# Altium project ECE453-S22.PrjPcb
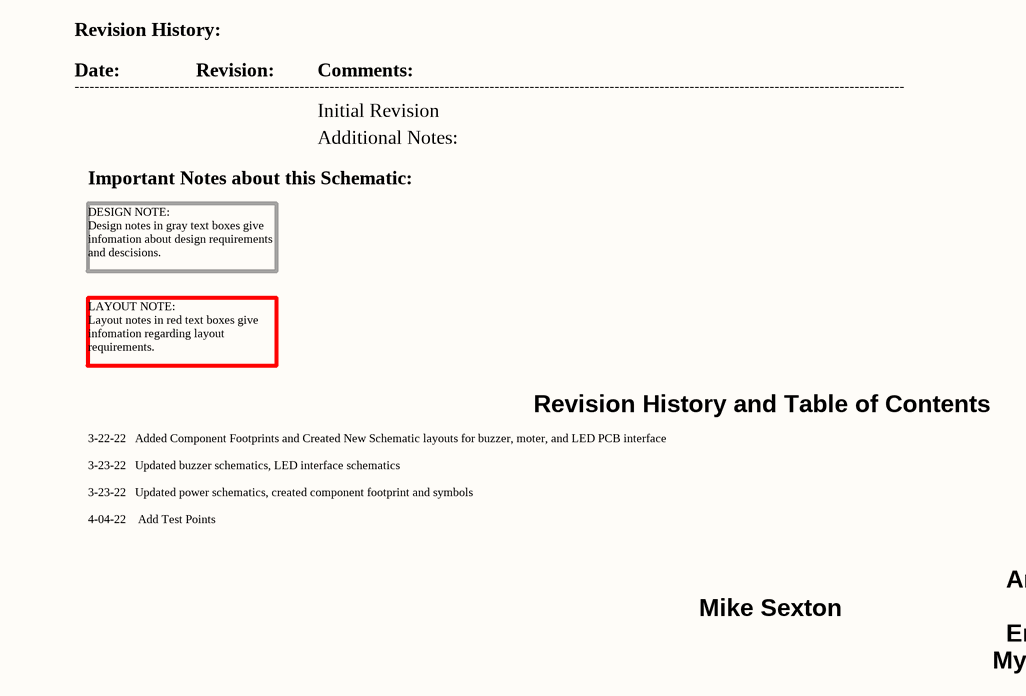
[diagram p0: 01-Revision_History_and_Contents.SchDoc]
6 sheets, 33 parts. Net scope: global (net labels, ports and power ports of the same name join across sheets).
Board file: ECE453_Interface.PcbDoc
Sheets:
  01-Revision_History_and_Contents.SchDoc
  02-Power.SchDoc
  03_MCU.SchDoc
  04_Motor.SchDoc
  05_Buzzer.SchDoc
  06_LEDs.SchDoc

## Sheet 01-Revision_History_and_Contents.SchDoc: Revision History and Contents
size A; Date: 4/25/2017; ApprovedBy: JSK; CheckedBy: JSK; Author: JSK; CompanyName: University of Wisconsin; DrawnBy: JSK; Engineer: JSK; Organization: ECE 315; Address1: College of Engineering; Address2: 1415 Engineering Drive; Address3: Madison, WI 53706; Address4: ECE 453 Spring 2017; Revision: A; SheetNumber: 1; SheetTotal: 2

### Notes on the sheet
- Revision History:
- Date:
- ----------------------------------------------------------------------------------------------------------------------------------------------------------------------
- Revision:
- Comments:
- Initial Revision
- Important Notes about this Schematic:
- Additional Notes:
- DESIGN NOTE:
  Design notes in gray text boxes give infomation about design requirements and descisions.
- LAYOUT NOTE:
  Layout notes in red text boxes give infomation regarding layout requirements.
- 3-22-22   Added Component Footprints and Created New Schematic layouts for buzzer, moter, and LED PCB interface
- Revision History and Table of Contents
- 3-23-22   Updated buzzer schematics, LED interface schematics
- 3-23-22   Updated power schematics, created component footprint and symbols
- 4-04-22    Add Test Points
- Anna Stephan
- Mike Sexton
- Emily Cebasek
- Mya Schmitz

## Sheet 02-Power.SchDoc: ECE315 Analog
size A; Date: 4/25/2017; ApprovedBy: JSK; CheckedBy: JSK; Author: JSK; CompanyName: University of Wisconsin; DrawnBy: JSK; Engineer: JSK; Organization: ECE 315; Address1: College of Engineering; Address2: 1415 Engineering Drive; Address3: Madison, WI 53706; Address4: ECE 315 Fall 2017; Revision: A; SheetNumber: 2; SheetTotal: 2; AssemblyNumber: ECE315-F19; ApprovedDate: 04/02/2019
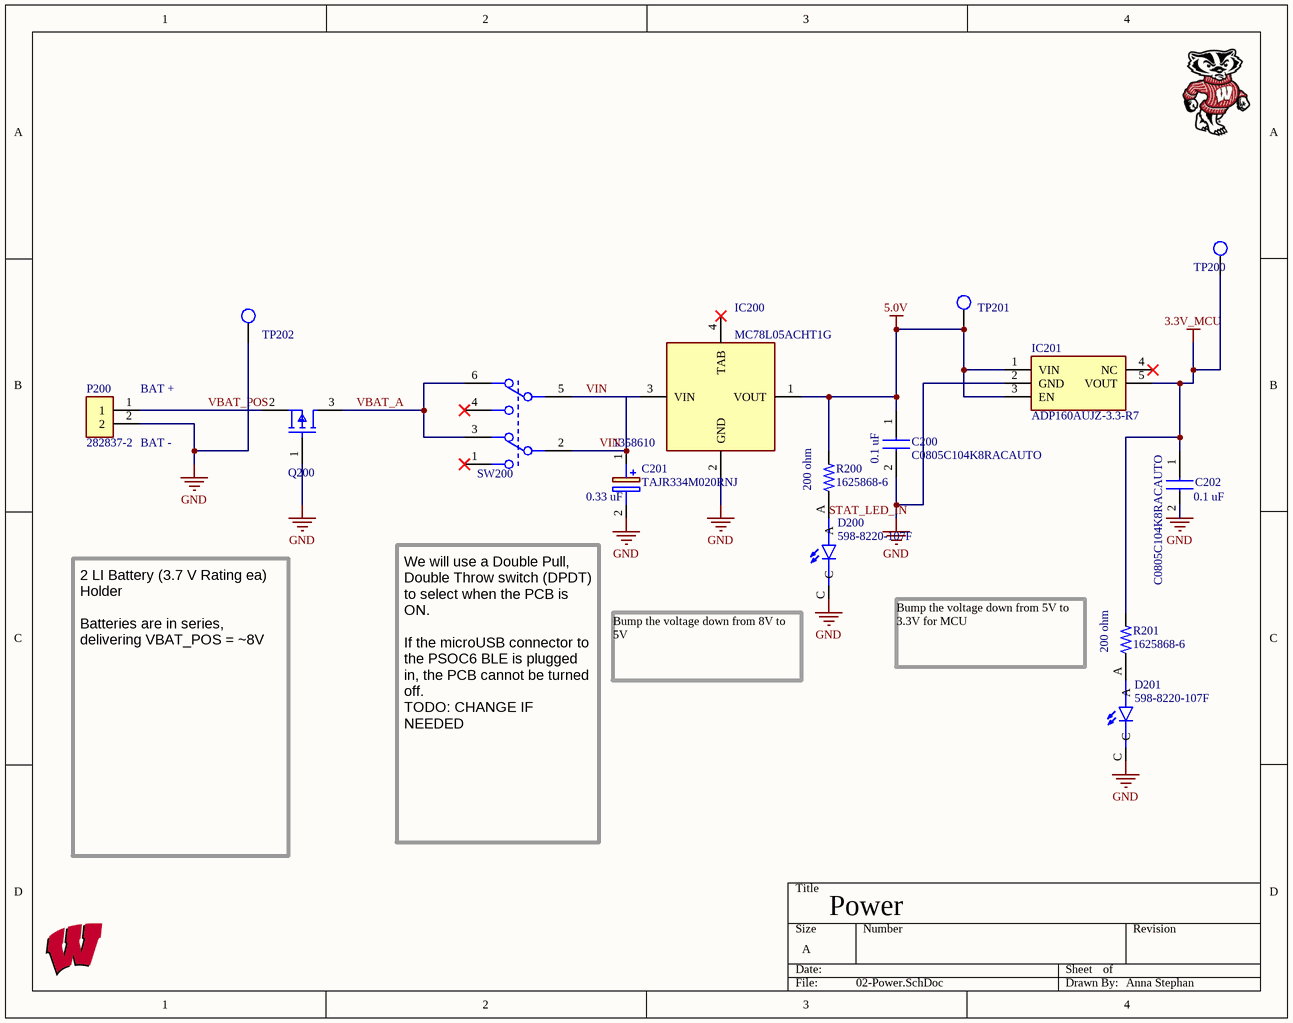
[diagram p1: 02-Power.SchDoc]

### Parts
C200  C0805C104K8RACAUTO  [CAPC2012X88N]
C201  TAJR334M020RNJ  Supplier Part Number 1: 1358610  [CAPM3216X18N]
C202  C0805C104K8RACAUTO  [CAPC2012X88N]
D200  598-8220-107F  [LEDSC160X320X90-2N]
D201  598-8220-107F  [LEDSC160X320X90-2N]
IC200  MC78L05ACHT1G  [SOT89-150P415X160-3N]
IC201  ADP160AUJZ-3.3-R7  [TSOT23127P600-8N]
P200  282837-2  [TE_282837-2]
Q200  SSM3J328R,LF  [SOT-23_M]  (value not drawn)
R200  1625868-6  [RESC2012X65N]
R201  1625868-6  [RESC2012X65N]
SW200  MHS22204  [C&K_Components_0_MFG]  (value not drawn)
TP200  TP_1206  [TP-SMC-1206]  (value not drawn)
TP201  TP_1206  [TP-SMC-1206]  (value not drawn)
TP202  TP_1206  [TP-SMC-1206]  (value not drawn)

### Nets
3.3V_MCU: C202.1 IC201.5(VOUT) R201.2 TP200.1
5.0V: C200.1 IC200.1(VOUT) IC201.1(VIN) IC201.3(EN) R200.2 TP201.1
GND: C200.2 C201.2(-) C202.2 D200.C D201.C IC200.2(GND) IC201.2(GND) P200.2 Q200.1(Gate) TP202.1
VBAT_A: Q200.3(Drain) SW200.3 SW200.6
VBAT_POS: P200.1 Q200.2(Source)
VIN: C201.1(+) IC200.3(VIN) SW200.2 SW200.5
NetD200_A: D200.A R200.1
NetD201_A: D201.A R201.1

Not connected (* = marked no-connect by the designer): IC200 4(TAB)*; IC201 4(NC)*; SW200 1* 4*

### Notes on the sheet
- (near P200) BAT +
- (near P200) BAT -
- (near C201) 0.33 uF
- (near R200) 200 ohm
- (near C200) 0.1 uF
- (near C202) 0.1 uF
- (near D200) Bump the voltage down from 8V to 5V
- Bump the voltage down from 5V to 3.3V for MCU
- (near R201) 200 ohm
- (near C201) We will use a Double Pull, Double Throw switch (DPDT) to select when the PCB is ON.
  If the microUSB connector to the PSOC6 BLE is plugged in, the PCB cannot be turned off.
  TODO: CHANGE IF NEEDED
- 2 LI Battery (3.7 V Rating ea) Holder
  Batteries are in series, delivering VBAT_POS = ~8V
- Power
- Anna Stephan
- Labels drawn without touching a wire or pin: STAT_LED_IN

### Library data of the parts
C200 C202 = C0805C104K8RACAUTO: Capacitor; Manufacturer_Name: Kemet; Datasheet Link: https://ad.componentsearchengine.com/Datasheets/2/C0805C104K8RACAUTO.pdf; Height: 0.88mm; Mouser2 Part Number: 80-C0805C104K8RAUTO; Manufacturer_Part_Number: C0805C104K8RACAUTO
C201 = TAJR334M020RNJ: Capacitor Polarised; Manufacturer_Name: AVX; Height: 1.2mm; Mouser2 Part Number: 581-TAJR334M020RNJ; Manufacturer_Part_Number: TAJR334M020RNJ; Supplier 1: RSComponents
D200 D201 = 598-8220-107F: Red 625nm LED Indication - Discrete 2V 1206 _3216 Metric_; MF: Dialight; Value: *; MP: 598-8220-107F; Package: 1206 Dialight; SnapEDA_Link: https://www.snapeda.com/parts/598-8220-107F/Dialight/view-part/454138/?ref=snap
IC200 = MC78L05ACHT1G: Integrated Circuit; Manufacturer_Name: ON Semiconductor; Datasheet Link: https://componentsearchengine.com//MC78L05ACHT1G.pdf; Mouser2 Part Number: 863-MC78L05ACHT1G; Mouser2 Price/Stock: https://www.mouser.com/Search/Refine.aspx?Keyword=863-MC78L05ACHT1G; Manufacturer_Part_Number: MC78L05ACHT1G
IC201 = ADP160AUJZ-3.0-R7: Integrated Circuit; Manufacturer_Name: Analog Devices; Datasheet Link: https://componentsearchengine.com/Datasheets/2/ADP160AUJZ-3.0-R7.pdf; Height: 1mm; Mouser2 Part Number: 584-ADP160AUJZ-3.3R7; Manufacturer_Part_Number: ADP160AUJZ-3.0-R7
P200 = 282837-2: Connector Terminal Blocks Receptacle 2 Position 5.08mm Solder Straight Thru-Hole 13.5A/Contact; Manufacturer: TE Connectivity AMP Connectors; MF: TE Connectivity; Price: None; Check_prices: https://www.snapeda.com/parts/282837-2/TE%20Connectivity%20AMP%20Connectors/view-part/2549980/?ref=eda; Package: None; Purchase-URL: https://pricing.snapeda.com/search/part/282837-2/?ref=eda; SnapEDA_Link: https://www.snapeda.com/parts/282837-2/TE%20Connectivity%20AMP%20Connectors/view-part/2549980/?ref=snap; Value: *; MP: 282837-2; Availability: Good; Manufacturer Part No.: 282837-2; Digikey Part No.: A113320-ND
Q200 = SSM3J328R,LF: MOSFET P-CH 20V 6A SOT23F; Manufacturer 1: Toshiba; Rds On Max: 29.8mR; Input Capacitance: 840pF; Max Power Dissipation: 1W; Gate to Source Voltage (Vgs): 8V; Turn-Off Delay Time: 107ns; Turn-On Delay Time: 32ns; Number of Channels: 1; Drain to Source Resistance: 47.4mR; Power Dissipation: 2W; Element Configuration: Single; Drain to Source Breakdown Voltage: -20V; Polarity: P-CHANNEL; Supplier 1: Digi-Key; Supplier Part Number 1: SSM3J328RLFCT-ND; Manufacturer Part Number 1: SSM3J328R,LF; RoHS: Yes; Category: MOSFETs; Stock 1: 476474; Pricing 1: 1=0.43000, 10=0.32200, 25=0.29040, 100=0.20060, 500=0.13728, 1000=0.10560 (USD); Mount: Surface Mount; Case/Package: SOT-23-3; Number of Pins: 3; Min Operating Temperature: -55°C; Max Operating Temperature: 150°C; Package Quantity: 3000; Packaging: Tape and Reel; Drain to Source Voltage (Vdss): 20V; Continuous Drain Current (ID): 6A; Number of Elements: 1; Radiation Hardening: No; RoHS Compliant: Yes; ComponentLink1URL: https://datasheet.ciiva.com/11158/ssm3j328r-datasheet-en-20140301-11158652.pdf?src-supplier=Avnet; ComponentLink1Description: https://datasheet.ciiva.com/11158/ssm3j328r-datasheet-en-20140301-11158652.pdf?src-supplier=Avnet; ComponentLink2URL: https://datasheet.ciiva.com/24106/ssm3j328r-datasheet-en-20140301-24106699.pdf?src-supplier=Mouser; ComponentLink2Description: https://datasheet.ciiva.com/24106/ssm3j328r-datasheet-en-20140301-24106699.pdf?src-supplier=Mouser; ComponentLink3URL: https://datasheet.ciiva.com/45425/ssm3j328r-datasheet-en-20140301-45425519.pdf?src-supplier=Digi-Key; ComponentLink3Description: https://datasheet.ciiva.com/45425/ssm3j328r-datasheet-en-20140301-45425519.pdf?src-supplier=Digi-Key; ComponentLink4URL: https://datasheet.ciiva.com/45425/ssm3j328r-datasheet-en-20140301-45425813.pdf?src-supplier=Digi-Key; ComponentLink4Description: https://datasheet.ciiva.com/45425/ssm3j328r-datasheet-en-20140301-45425813.pdf?src-supplier=Digi-Key
R200 R201 = 1625868-6: Resistor 0805 200R 0.1% 25ppm (reel); Package: None; Price: None; Value: *; MP: 1625868-6; Availability: Unavailable
SW200 = JS202011SCQN: C & K COMPONENTS - JS202011SCQN - SWITCH, DPDT, 0.6A, 6VDC, SMD; Manufacturer 1: TE Connectivity; Actuator Material: Nylon,Polyamide,PA46; Actuator Color: Black; Voltage Rating (DC): 6V; Current Rating: 300mA; Electrical Life: 5000Cycles; Switch Function: On-On; Contact Resistance: 70mR; Switch Travel: 2mm; Actuator Type: Standard; Supplier 1: Mouser; Supplier Part Number 1: 506-MHS22204; Manufacturer Part Number 1: MHS22204; RoHS: Yes; Category: Slide Switches; Stock 1: 21096; Pricing 1: 1=0.55000, 10=0.53000, 25=0.51040, 100=0.44180, 250=0.40252, 500=0.37306 (USD); Mount: Surface Mount; Contact Plating: Silver; Contact Material: Copper Alloy; Housing Material: Nylon; Min Operating Temperature: -20°C; Max Operating Temperature: 85°C; Throw Configuration: DPDT; Packaging: Tape and Reel; Package Quantity: 1; Termination: Gull Wing; Max Voltage Rating (DC): 6V; Series: JS; Max Current Rating: 300mA; Contact Current Rating: 300mA; Orientation: Vertical; Length: 9mm; Depth: 7.5mm; Actuator Length: 2mm; Radiation Hardening: No; REACH SVHC: No SVHC; Lead Free: Lead Free; Flammability Rating: UL94 V-2
TP200-TP202 = TP_1206: Test Point SMD 1206; Manufacturer: TE Connectivity (Tyco Electronics); Manufacturer Part Number: 1625854-1; Resistance Value: 0 Ohm; Temperature Coefficient: N/R; Supplier: Digi-Key; Stock 1: 31937; Pricing 1: 1=0.28, 10=0.261, 25=0.224, 50=0.1902, 100=0.1828, 250=0.1641, 500=0.1567, 1000=0.1306 (USD); Case Size: 1206; Dimension: 3.2 x 1.6 x 1.25mm; Family: RC; Mounting: Surface Mount; Operating Temperature: -55 to 125 C; Part No: 1625854-1; RoHS: Yes; Packaging: Tape and Reel; Termination Style: N/R; Terminal Pitch: N/R; Power Rating: N/R; Tolerance: N/R; ComponentLink1URL: https://datasheet.ciiva.com/6439/eng-ds-1773266-a-6439169.pdf; ComponentLink1Description: https://datasheet.ciiva.com/6439/eng-ds-1773266-a-6439169.pdf; ComponentLink2URL: https://datasheet.ciiva.com/30136/1773266-a-30136341.pdf; ComponentLink2Description: https://datasheet.ciiva.com/30136/1773266-a-30136341.pdf; ComponentLink3URL: https://datasheet.ciiva.com/6439/eng-ds-1773266-a-6439080.pdf; ComponentLink3Description: https://datasheet.ciiva.com/6439/eng-ds-1773266-a-6439080.pdf; ComponentLink4URL: https://datasheet.ciiva.com/6439/eng-ds-1773266-a-6439081.pdf; ComponentLink4Description: https://datasheet.ciiva.com/6439/eng-ds-1773266-a-6439081.pdf; ComponentLink5URL: https://datasheet.ciiva.com/6439/eng-ds-1773266-a-6439083.pdf; ComponentLink5Description: https://datasheet.ciiva.com/6439/eng-ds-1773266-a-6439083.pdf; Supplier Part Number: A106143CT-ND

## Sheet 03_MCU.SchDoc: ECE315 MCU
size A; Date: 4/25/2017; ApprovedBy: JSK; CheckedBy: JSK; Author: JSK; CompanyName: University of Wisconsin; DrawnBy: JSK; Engineer: JSK; Organization: ECE 315; Address1: College of Engineering; Address2: 1415 Engineering Drive; Address3: Madison, WI 53706; Address4: ECE 315 Fall 2017; Revision: A; SheetNumber: 3; SheetTotal: 6; AssemblyNumber: ECE315-F19; ApprovedDate: 04/02/2019
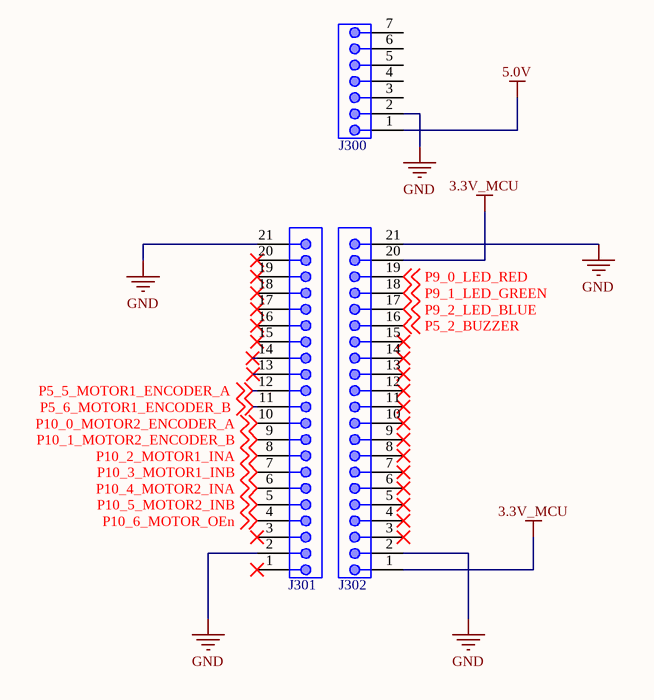
[diagram p2: 03_MCU.SchDoc]

### Parts
J300  CONN_HEADER_MALE_1x7  [HDR1X7_Stagger]  (value not drawn)
J301  CONN_HEADER_MALE_1x21  [HDR1X21 _Stagger]  (value not drawn)
J302  CONN_HEADER_MALE_1x21  [HDR1X21 _Stagger]  (value not drawn)

### Nets
3.3V_MCU: J302.1 J302.20
5.0V: J300.1
GND: J300.2 J301.2 J301.21 J302.2 J302.21
P5_2_BUZZER: J302.16 ; off-sheet P5_2_BUZZER
P5_5_MOTOR1_ENCODER_A: J301.12 ; off-sheet P5_5_MOTOR1_ENCODER_A
P5_6_MOTOR1_ENCODER_B: J301.11 ; off-sheet P5_6_MOTOR1_ENCODER_B
P9_0_LED_RED: J302.19 ; off-sheet P9_0_LED_RED
P9_1_LED_GREEN: J302.18 ; off-sheet P9_1_LED_GREEN
P9_2_LED_BLUE: J302.17 ; off-sheet P9_2_LED_BLUE
P10_0_MOTOR2_ENCODER_A: J301.10 ; off-sheet P10_0_MOTOR2_ENCODER_A
P10_1_MOTOR2_ENCODER_B: J301.9 ; off-sheet P10_1_MOTOR2_ENCODER_B
P10_2_MOTOR1_INA: J301.8 ; off-sheet P10_2_MOTOR1_INA
P10_3_MOTOR1_INB: J301.7 ; off-sheet P10_3_MOTOR1_INB
P10_4_MOTOR2_INA: J301.6 ; off-sheet P10_4_MOTOR2_INA
P10_5_MOTOR2_INB: J301.5 ; off-sheet P10_5_MOTOR2_INB
P10_6_MOTOR_OEn: J301.4 ; off-sheet P10_6_MOTOR_OEn

Not connected (* = marked no-connect by the designer): J300 3 4 5 6 7; J301 1* 3* 13* 14* 15* 16* 17* 18* 19* 20*; J302 3* 4* 5* 6* 7* 8* 9* 10* 11* 12* 13* 14* 15*

### Library data of the parts
J300 = CONN_HEADER_MALE_1x7: Header, 7-Pin; ComponentLink1URL: http://www.farnell.com/cad/1737268.pdf; ComponentLink1Description: http://www.farnell.com/cad/1737268.pdf; ComponentLink2URL: http://katalog.we-online.de/em/datasheet/6130xx11121.pdf; ComponentLink2Description: http://katalog.we-online.de/em/datasheet/6130xx11121.pdf; ComponentLink3URL: https://datasheet.ciiva.com/741/xrxczzzsxxn-rc-st-11635-b-741840.pdf?src-supplier=Digi-Key; ComponentLink3Description: https://datasheet.ciiva.com/741/xrxczzzsxxn-rc-st-11635-b-741840.pdf?src-supplier=Digi-Key
J301 J302 = CONN_HEADER_MALE_1x21: Header, 21-Pin; ComponentLink1URL: http://www.farnell.com/cad/1737268.pdf; ComponentLink1Description: http://www.farnell.com/cad/1737268.pdf; ComponentLink2URL: http://katalog.we-online.de/em/datasheet/6130xx11121.pdf; ComponentLink2Description: http://katalog.we-online.de/em/datasheet/6130xx11121.pdf; ComponentLink3URL: https://datasheet.ciiva.com/741/xrxczzzsxxn-rc-st-11635-b-741840.pdf?src-supplier=Digi-Key; ComponentLink3Description: https://datasheet.ciiva.com/741/xrxczzzsxxn-rc-st-11635-b-741840.pdf?src-supplier=Digi-Key

## Sheet 04_Motor.SchDoc
size A
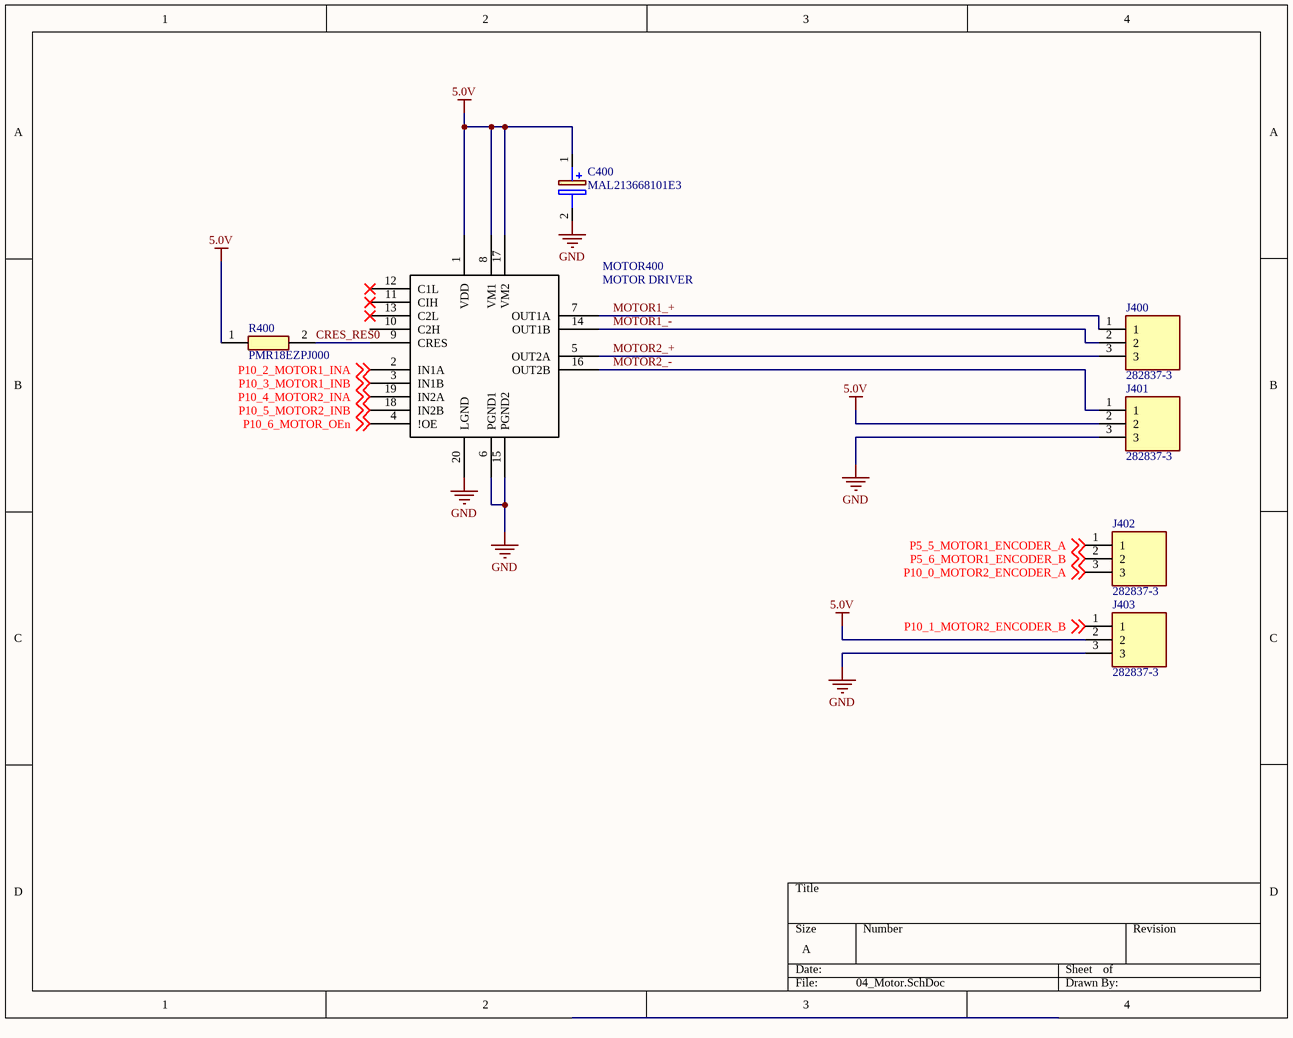
[diagram p3: 04_Motor.SchDoc]

### Parts
C400  MAL213668101E3  [CAPPRD500W60D1050H1750]
J400  282837-3  [2828373]
J401  282837-3  [2828373]
J402  282837-3  [2828373]
J403  282837-3  [2828373]
MOTOR400  MOTOR DRIVER  [SOP65P640X120-20N]
R400  PMR18EZPJ000  [RESC3216X42N]

### Nets
5.0V: C400.1(+) J401.2 J403.2 MOTOR400.1(VDD) MOTOR400.8(VM1) MOTOR400.17(VM2) R400.1
GND: C400.2(-) J401.3 J403.3 MOTOR400.6(PGND1) MOTOR400.15(PGND2) MOTOR400.20(LGND)
CRES_RES0: MOTOR400.9(CRES) R400.2
MOTOR1_+: J400.1 MOTOR400.7(OUT1A)
MOTOR1_-: J400.2 MOTOR400.14(OUT1B)
MOTOR2_+: J400.3 MOTOR400.5(OUT2A)
MOTOR2_-: J401.1 MOTOR400.16(OUT2B)
P5_5_MOTOR1_ENCODER_A: J402.1 ; off-sheet P5_5_MOTOR1_ENCODER_A
P5_6_MOTOR1_ENCODER_B: J402.2 ; off-sheet P5_6_MOTOR1_ENCODER_B
P10_0_MOTOR2_ENCODER_A: J402.3 ; off-sheet P10_0_MOTOR2_ENCODER_A
P10_1_MOTOR2_ENCODER_B: J403.1 ; off-sheet P10_1_MOTOR2_ENCODER_B
P10_2_MOTOR1_INA: MOTOR400.2(IN1A) ; off-sheet P10_2_MOTOR1_INA
P10_3_MOTOR1_INB: MOTOR400.3(IN1B) ; off-sheet P10_3_MOTOR1_INB
P10_4_MOTOR2_INA: MOTOR400.19(IN2A) ; off-sheet P10_4_MOTOR2_INA
P10_5_MOTOR2_INB: MOTOR400.18(IN2B) ; off-sheet P10_5_MOTOR2_INB
P10_6_MOTOR_OEn: MOTOR400.4(!OE) ; off-sheet P10_6_MOTOR_OEn

Not connected (* = marked no-connect by the designer): MOTOR400 10(C2H) 11(CIH)* 12(C1L)* 13(C2L)*

### Library data of the parts
C400 = MAL213668101E3: Capacitor Polarised; Manufacturer_Name: Vishay; Datasheet Link: https://componentsearchengine.com//MAL213668101E3.pdf; Height: 17.5mm; Mouser2 Part Number: N/A; Mouser2 Price/Stock: https://www.mouser.com/Search/Refine.aspx?Keyword=N%2FA; Manufacturer_Part_Number: MAL213668101E3
J400-J403 = 282837-3: Connector; Manufacturer_Name: TE Connectivity; Height: 10.3mm; Manufacturer_Part_Number: 282837-3
MOTOR400 = SOP65P64X1
R400 = PMR18EZPJ000: Resistor; Manufacturer_Name: ROHM Semiconductor; Datasheet Link: https://fscdn.rohm.com/en/products/databook/datasheet/passive/resistor/chip_resistor/pmr-jpw-e.pdf; Height: 0.42mm; Manufacturer_Part_Number: PMR18EZPJ000

## Sheet 05_Buzzer.SchDoc
size A; SPICEModelCacheOKCZUNHO: <root> / <DocumentId>OKCZUNHO</DocumentId> / <CacheFrame Number="0"> / <Model Name="10tq035" Kind="MDL"> / <Text>*10TQ035 MCE 3/26/98 / *Ref: IR Power Semiconductors Product Digest '94 / *MCE 35V 10A 3us pkg:TO-220 3,1 / .MODEL 10TQ035 D (IS=14.2N RS=4.2M N=1.7 BV=35 IBV=15M / + CJO=412P VJ=0.75 M=0.333 TT=4.32U EG=.69 XTI=2)</Text> / </Model> / </CacheFrame> / </root>
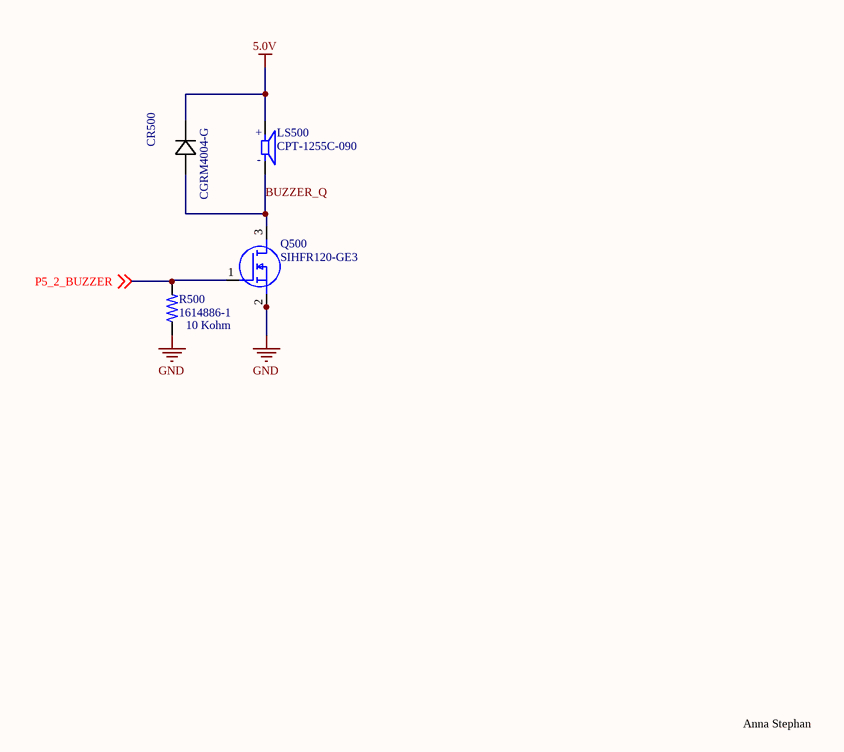
[diagram p4: 05_Buzzer.SchDoc]

### Parts
CR500  CGRM4004-G  [CGRM]
LS500  CPT-1255C-090  [CUI_CPT-1255C-090]
Q500  SIHFR120-GE3  [SIHFR120GE3]
R500  1614886-1  [RESC2012X65N]

### Nets
5.0V: CR500.1 LS500.P
GND: Q500.2(S) R500.1
BUZZER_Q: CR500.2 LS500.N Q500.3(D)
P5_2_BUZZER: Q500.1(G) R500.2 ; off-sheet P5_2_BUZZER

### Notes on the sheet
- (near R500) 10 Kohm
- Anna Stephan
- (in symbol CPT-1255C-090) +; -

### Library data of the parts
CR500 = CGRM4004-G: No Description Available; Mfr_Name: Comchip; Type: DEV; Copyright: Copyright (C) 2022 Ultra Librarian. All rights reserved.; Manufacturer_Part_Number: CGRM4004-G; Digi-Key_Part_Number_1: 641-1329-1-ND; Digi-Key_Part_Number_2: 641-1329-2-ND; Digi-Key_Part_Number_3: 641-1329-2-NDL; Digi-Key_Part_Number_4: 641-1329-6-ND; RefDes: RefDes
LS500 = CPT-1255C-090: 12 mm, 20 Vp-p, 80 dB, Through Hole, Piezo Audio Transducer Buzzer; MF: CUI Devices; SnapEDA_Link: https://www.snapeda.com/parts/CPT-1255C-090/CUI%20Devices/view-part/2202985/?ref=snap; MP: CPT-1255C-090; Availability: Unavailable; Price: None; Value: *; Manufacturer: CUI Devices; Manufacturer Part No.: CPT-1255C-090; Digikey Part No.: 102-3752-ND
Q500 = SIHFR120-GE3: MOSFET (N-Channel); Manufacturer_Name: Vishay; Datasheet Link: https://www.mouser.in/datasheet/2/427/91266-1768752.pdf; Height: 2.38mm; Mouser2 Part Number: 78-SIHFR120-GE3; Manufacturer_Part_Number: SIHFR120-GE3
R500 = 1614886-1: CPF0805 10K 0.1% 25PPM 5K RL; Power_Rating: .1 W; Tolerance: .1%; Voltage_Rating: 100 V; MF: TE Connectivity; Availability: Warning; Price: None; Package: 0805; MP: 1614886-1; Value: *; EU_RoHS_Compliance: Compliant; SnapEDA_Link: https://www.snapeda.com/parts/1614886-1/TE%20Connectivity/view-part/2202344/?ref=snap; Resistance: 10K; Check_prices: https://www.snapeda.com/parts/1614886-1/TE%20Connectivity/view-part/2202344/?ref=eda

## Sheet 06_LEDs.SchDoc
size A
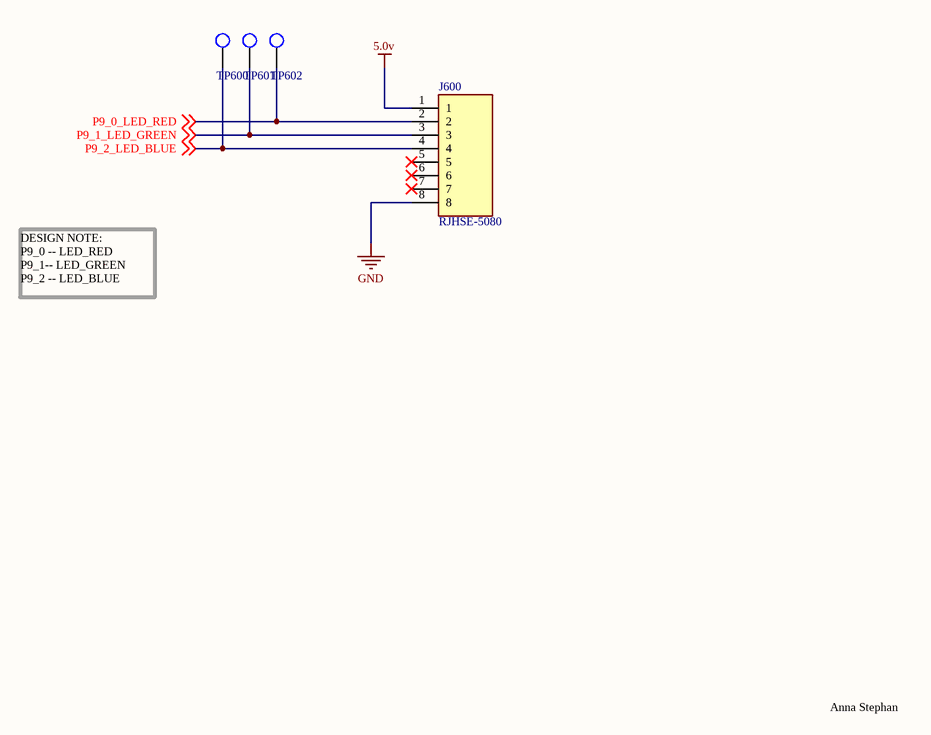
[diagram p5: 06_LEDs.SchDoc]

### Parts
J600  RJHSE-5080  [CONN_RJSBE5080_16P13X12P57_AMP]
TP600  TP_1206  [TP-SMC-1206]  (value not drawn)
TP601  TP_1206  [TP-SMC-1206]  (value not drawn)
TP602  TP_1206  [TP-SMC-1206]  (value not drawn)

### Nets
5.0V: J600.1
GND: J600.8
P9_0_LED_RED: J600.2 TP602.1 ; off-sheet P9_0_LED_RED
P9_1_LED_GREEN: J600.3 TP601.1 ; off-sheet P9_1_LED_GREEN
P9_2_LED_BLUE: J600.4 TP600.1 ; off-sheet P9_2_LED_BLUE

Not connected (* = marked no-connect by the designer): J600 5* 6* 7*

### Notes on the sheet
- DESIGN NOTE:
  P9_0 -- LED_RED
  P9_1-- LED_GREEN
  P9_2 -- LED_BLUE
- Anna Stephan

### Library data of the parts
J600 = RJHSE-5080: Jack Modular Connector 8p8c (RJ45, Ethernet) 90Â° Angle (Right) Unshielded; Manufacturer: Amphenol CS (Commercial Products); MF: Amphenol Commercial Products; MP: RJHSE-5080; SnapEDA_Link: https://www.snapeda.com/parts/RJHSE-5080/Amphenol/view-part/4796273/?ref=snap; Package: None; Value: *; Digi-Key_Part_Number: RJHSE-5080-ND; Manufacturer Part No.: RJHSE-5080; Digikey Part No.: RJHSE-5080-ND
TP600-TP602 = TP_1206: as TP200 on sheet 02-Power; Supplier: Digi-Key; Stock 1: 31937; Pricing 1: 1=0.28, 10=0.261, 25=0.224, 50=0.1902, 100=0.1828, 250=0.1641, 500=0.1567, 1000=0.1306 (USD); Case Size: 1206; Dimension: 3.2 x 1.6 x 1.25mm; Family: RC; Mounting: Surface Mount; Operating Temperature: -55 to 125 C; Part No: 1625854-1; RoHS: Yes; Packaging: Tape and Reel; Termination Style: N/R; Terminal Pitch: N/R; Power Rating: N/R; Tolerance: N/R; ComponentLink1URL: https://datasheet.ciiva.com/6439/eng-ds-1773266-a-6439169.pdf; ComponentLink1Description: https://datasheet.ciiva.com/6439/eng-ds-1773266-a-6439169.pdf; ComponentLink2URL: https://datasheet.ciiva.com/30136/1773266-a-30136341.pdf; ComponentLink2Description: https://datasheet.ciiva.com/30136/1773266-a-30136341.pdf; ComponentLink3URL: https://datasheet.ciiva.com/6439/eng-ds-1773266-a-6439080.pdf; ComponentLink3Description: https://datasheet.ciiva.com/6439/eng-ds-1773266-a-6439080.pdf; ComponentLink4URL: https://datasheet.ciiva.com/6439/eng-ds-1773266-a-6439081.pdf; ComponentLink4Description: https://datasheet.ciiva.com/6439/eng-ds-1773266-a-6439081.pdf; ComponentLink5URL: https://datasheet.ciiva.com/6439/eng-ds-1773266-a-6439083.pdf; ComponentLink5Description: https://datasheet.ciiva.com/6439/eng-ds-1773266-a-6439083.pdf; Supplier Part Number: A106143CT-ND

## Nets that join several sheets
3.3V_MCU: 02-Power (C202.1 IC201.5 R201.2 TP200.1), 03_MCU (J302.1 J302.20)
5.0V: 02-Power (6 pins), 03_MCU (J300.1), 04_Motor (7 pins), 05_Buzzer (CR500.1 LS500.P), 06_LEDs (J600.1)
GND: 02-Power (10 pins), 03_MCU (5 pins), 04_Motor (6 pins), 05_Buzzer (Q500.2 R500.1), 06_LEDs (J600.8)
P5_2_BUZZER: 03_MCU (J302.16), 05_Buzzer (Q500.1 R500.2)
P5_5_MOTOR1_ENCODER_A: 03_MCU (J301.12), 04_Motor (J402.1)
P5_6_MOTOR1_ENCODER_B: 03_MCU (J301.11), 04_Motor (J402.2)
P9_0_LED_RED: 03_MCU (J302.19), 06_LEDs (J600.2 TP602.1)
P9_1_LED_GREEN: 03_MCU (J302.18), 06_LEDs (J600.3 TP601.1)
P9_2_LED_BLUE: 03_MCU (J302.17), 06_LEDs (J600.4 TP600.1)
P10_0_MOTOR2_ENCODER_A: 03_MCU (J301.10), 04_Motor (J402.3)
P10_1_MOTOR2_ENCODER_B: 03_MCU (J301.9), 04_Motor (J403.1)
P10_2_MOTOR1_INA: 03_MCU (J301.8), 04_Motor (MOTOR400.2)
P10_3_MOTOR1_INB: 03_MCU (J301.7), 04_Motor (MOTOR400.3)
P10_4_MOTOR2_INA: 03_MCU (J301.6), 04_Motor (MOTOR400.19)
P10_5_MOTOR2_INB: 03_MCU (J301.5), 04_Motor (MOTOR400.18)
P10_6_MOTOR_OEn: 03_MCU (J301.4), 04_Motor (MOTOR400.4)